# EasyEDA schematic SCH_Emon.json
TITLE: Main_brd; REV: 1.0; Date: 2024-08-25; Sheet: 1/1; Drawn By: MartinVacik; Company: Your Company
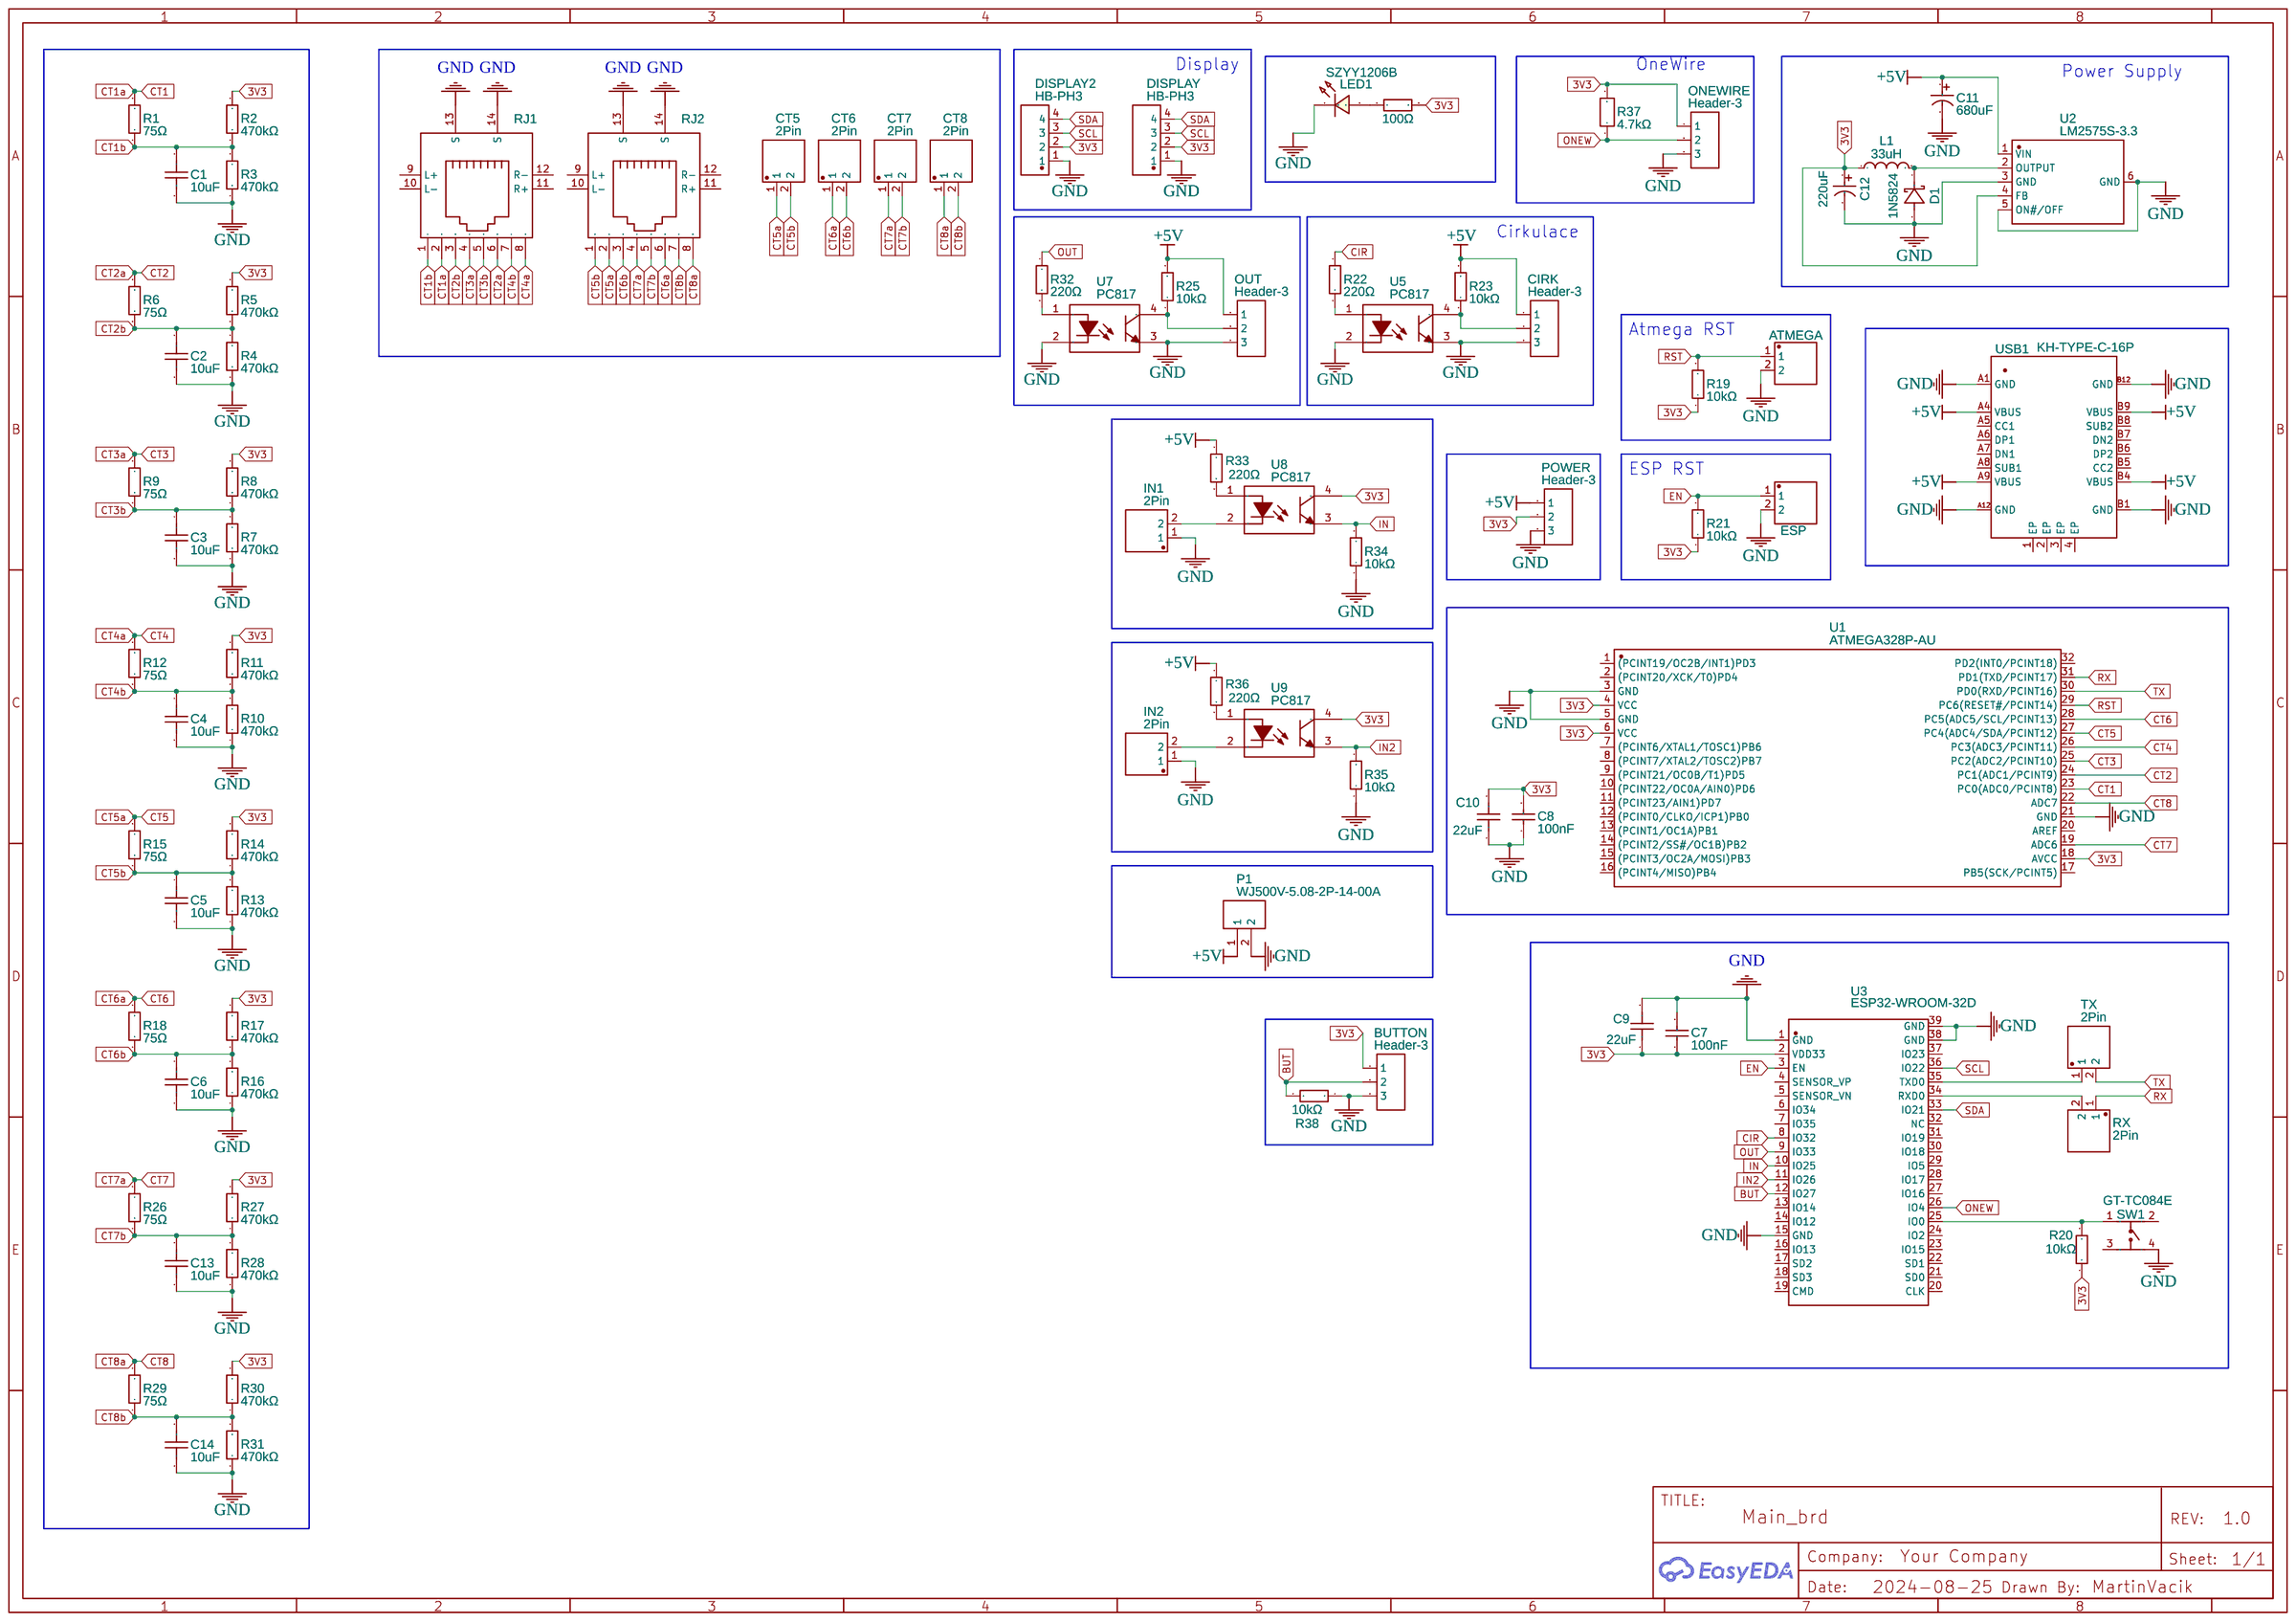
[diagram p0: schematic sheet]

## Parts
ATMEGA  Atmega  [HDR-TH_2P-P2.54-V-M-1]
BUTTON  Header-3  [HDR-TH_3P-P2.54-V-M-1]
C1  10uF  [C1206]
C2  10uF  [C1206]
C3  10uF  [C1206]
C4  10uF  [C1206]
C5  10uF  [C1206]
C6  10uF  [C1206]
C7  100nF  [C1206]
C8  100nF  [C1206]
C9  22uF  [C1206]
C10  22uF  [C1206]
C11  680uF  [CAP-TH_BD10.0-P5.00-D1.0-FD]
C12  220uF  [CAP-TH_BD6.3-P2.50-D1.0-FD]
C13  10uF  [C1206]
C14  10uF  [C1206]
CIRK  Header-3  [HDR-TH_3P-P2.54-V-M-1]
CT5  2Pin  [HDR-TH_2P-P2.54-V-M-1]
CT6  2Pin  [HDR-TH_2P-P2.54-V-M-1]
CT7  2Pin  [HDR-TH_2P-P2.54-V-M-1]
CT8  2Pin  [HDR-TH_2P-P2.54-V-M-1]
D1  1N5824  [DO-27_BD5.3-L8.4-P12.40-D1.3-RD]
DISPLAY  HB-PH3  [HDR-TH_4P-P2.54-V-M]
DISPLAY2  HB-PH3  [HDR-TH_4P-P2.54-V-M]
ESP  ESP  [HDR-TH_2P-P2.54-V-M-1]
IN1  2Pin  [HDR-TH_2P-P2.54-V-M-1]
IN2  2Pin  [HDR-TH_2P-P2.54-V-M-1]
L1  33uH  [IND-SMD_L7.0-W6.6_FXL0650]
LED1  SZYY1206B  [LED1206-RD_BLUE]
ONEWIRE  Header-3  [HDR-TH_3P-P2.54-V-M-1]
OUT  Header-3  [HDR-TH_3P-P2.54-V-M-1]
P1  WJ500V-5.08-2P-14-00A  [CONN-TH_2P-P5.00_WJ500V-5.08-2P]
POWER  Header-3  [HDR-TH_3P-P2.54-V-M-1]
R1  75Ω  [R1206]
R2  470kΩ  [R1206]
R3  470kΩ  [R1206]
R4  470kΩ  [R1206]
R5  470kΩ  [R1206]
R6  75Ω  [R1206]
R7  470kΩ  [R1206]
R8  470kΩ  [R1206]
R9  75Ω  [R1206]
R10  470kΩ  [R1206]
R11  470kΩ  [R1206]
R12  75Ω  [R1206]
R13  470kΩ  [R1206]
R14  470kΩ  [R1206]
R15  75Ω  [R1206]
R16  470kΩ  [R1206]
R17  470kΩ  [R1206]
R18  75Ω  [R1206]
R19  10kΩ  [R1206]
R20  10kΩ  [R1206]
R21  10kΩ  [R1206]
R22  220Ω  [R1206]
R23  10kΩ  [R1206]
R24  100Ω  [R1206]
R25  10kΩ  [R1206]
R26  75Ω  [R1206]
R27  470kΩ  [R1206]
R28  470kΩ  [R1206]
R29  75Ω  [R1206]
R30  470kΩ  [R1206]
R31  470kΩ  [R1206]
R32  220Ω  [R1206]
R33  220Ω  [R1206]
R34  10kΩ  [R1206]
R35  10kΩ  [R1206]
R36  220Ω  [R1206]
R37  4.7kΩ  [R1206]
R38  10kΩ  [R1206]
RJ1  R-RJ45R08P-C000  [RJ45-TH_R-RJ45R08P-C000]
RJ2  R-RJ45R08P-C000  [RJ45-TH_R-RJ45R08P-C000]
RX  2Pin  [HDR-TH_2P-P2.54-V-M-1]
SW1  GT-TC084E  [SW-SMD_4P-L5.2-W5.2-P3.70-LS6.4]
TX  2Pin  [HDR-TH_2P-P2.54-V-M-1]
U1  ATMEGA328P-AU  [TQFP-32_L7.0-W7.0-P0.80-LS9.0-BL]
U2  LM2575S-3.3  [TO-263-5_L10.0-W8.4-P1.70-LS15.3-BR]
U3  ESP32-WROOM-32D  [WIFIM-SMD_39P-L25.5-W18.0-P1.27-BL]
U5  PC817  [SMD-4_L4.6-W6.5-P2.54-LS10.2-TL]
U7  PC817  [SMD-4_L4.6-W6.5-P2.54-LS10.2-TL]
U8  PC817  [SMD-4_L4.6-W6.5-P2.54-LS10.2-TL]
U9  PC817  [SMD-4_L4.6-W6.5-P2.54-LS10.2-TL]
USB1  KH-TYPE-C-16P  [USB-C-SMD_KH-TYPE-C-16P]

## Library data of the parts
ATMEGA CT5-CT8 ESP IN1 IN2 RX TX = 210S-1*2P L=11.6MMGold-plated black: Contributor: LCSC; Supplier: LCSC; Manufacturer: Ckmtw(灿科盟); Manufacturer Part: B-2100S02P-A110; Supplier Part: C124375; JLCPCB Part Class: Extended Part
BUTTON CIRK ONEWIRE OUT POWER = Header-Male-2.54_1x3: Supplier: LCSC; Manufacturer: BOOMELE(博穆精密); Manufacturer Part: 2.54-1*3P针; Supplier Part: C49257; JLCPCB Part Class: Extended Part
C1-C6 C13 C14 = 1206B106K100NT: Contributor: LCSC; Supplier: LCSC; Manufacturer: FH(风华); Supplier Part: C165101; JLCPCB Part Class: Extended Part
C7 C8 = 1206B104K500NT: Supplier: LCSC; Manufacturer: FH(风华); Supplier Part: C110253; JLCPCB Part Class: Extended Part
C9 C10 = CL31A226KOHNNNE: Supplier: LCSC; Manufacturer: SAMSUNG(三星); Supplier Part: C90146; JLCPCB Part Class: Extended Part
C11 = 680uF 25V: Supplier: LCSC; Manufacturer: CX(承兴); Manufacturer Part: GR687M025G17RR0VL4FP0; Supplier Part: C42281; JLCPCB Part Class: Extended Part
C12 = 220uF 16V Black high frequency: Supplier: LCSC; Manufacturer: CX(承兴); Manufacturer Part: ZF227M016E07RR0VH4FP0; Supplier Part: C35799; JLCPCB Part Class: Extended Part
D1 = 1N5824_C7503125: Supplier: LCSC; Supplier Part: C7503125; Manufacturer: FUXINSEMI(富芯森美); JLCPCB Part Class: Extended Part; Contributor: lcsc
DISPLAY DISPLAY2 = HB-PH3-25414PB2GOP: Contributor: lcsc; Supplier: LCSC; Supplier Part: C6332197; Manufacturer: HANBO(汉博); JLCPCB Part Class: Extended Part
L1 = FXL0650-330-M: Contributor: LCSC; Supplier: LCSC; Supplier Part: C475526; Manufacturer: cjiang(长江微电); JLCPCB Part Class: Extended Part
LED1 = SZYY1206B: Contributor: LCSC; Supplier: LCSC; Supplier Part: C434440; Manufacturer: yongyu(永裕光电); JLCPCB Part Class: Extended Part
P1 = WJ500V-5.08-2P-14-00A: Supplier: LCSC; Manufacturer: KANGNEX(康奈克斯电气); Manufacturer Part: WJ500V-5.08-2P; Supplier Part: C8465; JLCPCB Part Class: Extended Part
R1 R6 R9 R12 R15 R18 R26 R29 = 1206W4J0750T5E: Supplier: LCSC; Manufacturer: UNI-ROYAL(厚声); Supplier Part: C25394; JLCPCB Part Class: Extended Part; link: https://lcsc.com/eda_search?q=C25394&%26type=1&ref=editor
R2-R5 R7 R8 R10 R11 R13 R14 R16 R17 R27 R28 R30 R31 = 1206W4F4703T5E: Supplier: LCSC; Manufacturer: UNI-ROYAL(厚声); Supplier Part: C17997; JLCPCB Part Class: Extended Part
R19-R21 R23 R25 R34 R35 R38 = 1206W4F1002T5E: Supplier: LCSC; Manufacturer: UNI-ROYAL(厚声); Supplier Part: C17902; JLCPCB Part Class: Basic Part
R22 R32 R33 R36 = 1206W4J0221T5E: Supplier: LCSC; Manufacturer: UNI-ROYAL(厚声); Supplier Part: C25363; JLCPCB Part Class: Extended Part
R24 = 1206W4F1000T5E: Supplier: LCSC; Manufacturer: UNI-ROYAL(厚声); Supplier Part: C17901; JLCPCB Part Class: Basic Part
R37 = FRC1206J472 TS: Supplier: LCSC; Supplier Part: C2907499; Manufacturer: FOJAN(富捷); JLCPCB Part Class: Extended Part; Contributor: lcsc
RJ1 RJ2 = R-RJ45R08P-C000: Contributor: LCSC; Supplier: LCSC; Supplier Part: C386757; Manufacturer: Ckmtw(灿科盟); JLCPCB Part Class: Extended Part
SW1 = GT-TC084E-H017-L5: Contributor: LCSC; Supplier: LCSC; Supplier Part: C2837075; Manufacturer: G-Switch(品赞); JLCPCB Part Class: Extended Part
U1 = ATMEGA328P-AU: Supplier: LCSC; Manufacturer: MICROCHIP(美国微芯); Supplier Part: C14877; JLCPCB Part Class: Extended Part
U2 = LM2575S-3.3_C347404: Contributor: LCSC; Supplier: LCSC; Supplier Part: C347404; Manufacturer: UMW(友台半导体); JLCPCB Part Class: Extended Part
U3 = ESP32-WROOM-32D: Contributor: LCSC; Supplier: LCSC; Supplier Part: C473012; Manufacturer: ESPRESSIF(乐鑫); Manufacturer Part: ESP32-WROOM-32D-N4; JLCPCB Part Class: Extended Part
U5 U7-U9 = PC817X2CSP9F: Supplier: LCSC; Manufacturer: SHARP(夏普); Supplier Part: C66405; JLCPCB Part Class: Extended Part
USB1 = KH-TYPE-C-16P: Contributor: LCSC; Supplier: LCSC; Supplier Part: C709357; Manufacturer: kinghelm(金航标); JLCPCB Part Class: Extended Part

## Nets
3V3: BUTTON.1 C7.1 C8.2 C9.1 C10.2 C12.1 DISPLAY.2 DISPLAY2.2 L1.1 ONEWIRE.1 POWER.2 R2.2 R5.2 R8.2 R11.2 R14.2 R17.2 R19.1 R20.1 R21.1 R24.2 R27.2 R30.2 R37.2 U1.4(VCC) U1.6(VCC) U1.18(AVCC) U2.4(FB) U3.2(VDD33) U8.4 U9.4
+5V: C11.1 CIRK.1 OUT.1 P1.1 POWER.1 R23.2 R25.2 R33.1 R36.1 U2.1(VIN) USB1.A4(VBUS) USB1.A9(VBUS) USB1.B4(VBUS) USB1.B9(VBUS)
GND: ATMEGA.2 BUTTON.3 C1.2 C2.2 C3.2 C4.2 C5.2 C6.2 C7.2 C8.1 C9.2 C10.1 C11.2 C12.2 C13.2 C14.2 CIRK.3 D1.2(A) DISPLAY.1 DISPLAY2.1 ESP.2 IN1.1 IN2.1 LED1.1 ONEWIRE.3 OUT.3 P1.2 POWER.3 R3.1 R4.1 R7.1 R10.1 R13.1 R16.1 R28.1 R31.1 R34.1 R35.1 R38.1 RJ1.13(S) RJ1.14(S) RJ2.13(S) RJ2.14(S) SW1.4 U1.3(GND) U1.5(GND) U1.21(GND) U2.3(GND) U2.5(ON#/OFF) U2.6(GND) U3.1(GND) U3.15(GND) U3.38(GND) U3.39(GND) U5.2 U5.3 U7.2 U7.3 USB1.A1(GND) USB1.A12(GND) USB1.B1(GND) USB1.B12(GND)
BUT: BUTTON.2 R38.2 U3.12(IO27)
CIR: R22.1 U3.8(IO32)
CT1: R1.2 RJ1.2 U1.23(PC0(ADC0/PCINT8))
CT1b: C1.1 R1.1 R2.1 R3.2 RJ1.1
CT2: R6.2 RJ1.6 U1.24(PC1(ADC1/PCINT9))
CT2b: C2.1 R4.2 R5.1 R6.1 RJ1.3
CT3: R9.2 RJ1.4 U1.25(PC2(ADC2/PCINT10))
CT3b: C3.1 R7.2 R8.1 R9.1 RJ1.5
CT4: R12.2 RJ1.8 U1.26(PC3(ADC3/PCINT11))
CT4b: C4.1 R10.2 R11.1 R12.1 RJ1.7
CT5: CT5.1 R15.2 RJ2.2 U1.27(PC4(ADC4/SDA/PCINT12))
CT5b: C5.1 CT5.2 R13.2 R14.1 R15.1 RJ2.1
CT6: CT6.1 R18.2 RJ2.6 U1.28(PC5(ADC5/SCL/PCINT13))
CT6b: C6.1 CT6.2 R16.2 R17.1 R18.1 RJ2.3
CT7: CT7.1 R26.2 RJ2.4 U1.19(ADC6)
CT7b: C13.1 CT7.2 R26.1 R27.1 R28.2 RJ2.5
CT8: CT8.1 R29.2 RJ2.8 U1.22(ADC7)
CT8b: C14.1 CT8.2 R29.1 R30.1 R31.2 RJ2.7
EN: ESP.1 R21.2 U3.3(EN)
IN: R34.2 U3.10(IO25) U8.3
IN2: R35.2 U3.11(IO26) U9.3
ONEW: ONEWIRE.2 R37.1 U3.26(IO4)
OUT: R32.1 U3.9(IO33)
RST: ATMEGA.1 R19.2 U1.29(PC6(RESET#/PCINT14))
RX: RX.1 U1.31(PD1(TXD/PCINT17))
SCL: DISPLAY.3 DISPLAY2.3 U3.36(IO22)
SDA: DISPLAY.4 DISPLAY2.4 U3.33(IO21)
TX: TX.2 U1.30(PD0(RXD/PCINT16))
Net-(CIRK-2): CIRK.2 R23.1 U5.4
Net-(D1-1): D1.1(K) L1.2 U2.2(OUTPUT)
Net-(IN1-2): IN1.2 U8.2
Net-(IN2-2): IN2.2 U9.2
Net-(LED1-2): LED1.2 R24.1
Net-(OUT-2): OUT.2 R25.1 U7.4
Net-(R20-2): R20.2 SW1.1 U3.25(IO0)
Net-(R22-2): R22.2 U5.1
Net-(R32-2): R32.2 U7.1
Net-(R33-2): R33.2 U8.1
Net-(R36-2): R36.2 U9.1
Net-(RX-2): RX.2 U3.34(RXD0)
Net-(TX-1): TX.1 U3.35(TXD0)

Not connected (* = marked no-connect by the designer): RJ1 9(L+) 10(L-) 11(R+) 12(R-); RJ2 9(L+) 10(L-) 11(R+) 12(R-); SW1 2 3; U1 1((PCINT19/OC2B/INT1)PD3) 2((PCINT20/XCK/T0)PD4) 7((PCINT6/XTAL1/TOSC1)PB6) 8((PCINT7/XTAL2/TOSC2)PB7) 9((PCINT21/OC0B/T1)PD5) 10((PCINT22/OC0A/AIN0)PD6) 11((PCINT23/AIN1)PD7) 12((PCINT0/CLKO/ICP1)PB0) 13((PCINT1/OC1A)PB1) 14((PCINT2/SS#/OC1B)PB2) 15((PCINT3/OC2A/MOSI)PB3) 16((PCINT4/MISO)PB4) 17(PB5(SCK/PCINT5)) 20(AREF) 32(PD2(INT0/PCINT18)); U3 4(SENSOR_VP) 5(SENSOR_VN) 6(IO34) 7(IO35) 13(IO14) 14(IO12) 16(IO13) 17(SD2) 18(SD3) 19(CMD) 20(CLK) 21(SD0) 22(SD1) 23(IO15) 24(IO2) 27(IO16) 28(IO17) 29(IO5) 30(IO18) 31(IO19) 32(NC) 37(IO23); USB1 1(EP) 2(EP) 3(EP) 4(EP) A5(CC1) A6(DP1) A7(DN1) A8(SUB1) B5(CC2) B6(DP2) B7(DN2) B8(SUB2)

## Notes on the sheet
- Display
- OneWire
- Power Supply
- Cirkulace
- Atmega RST
- ESP RST
